# EAGLE design BitRegister (EAGLE 9.2.2)
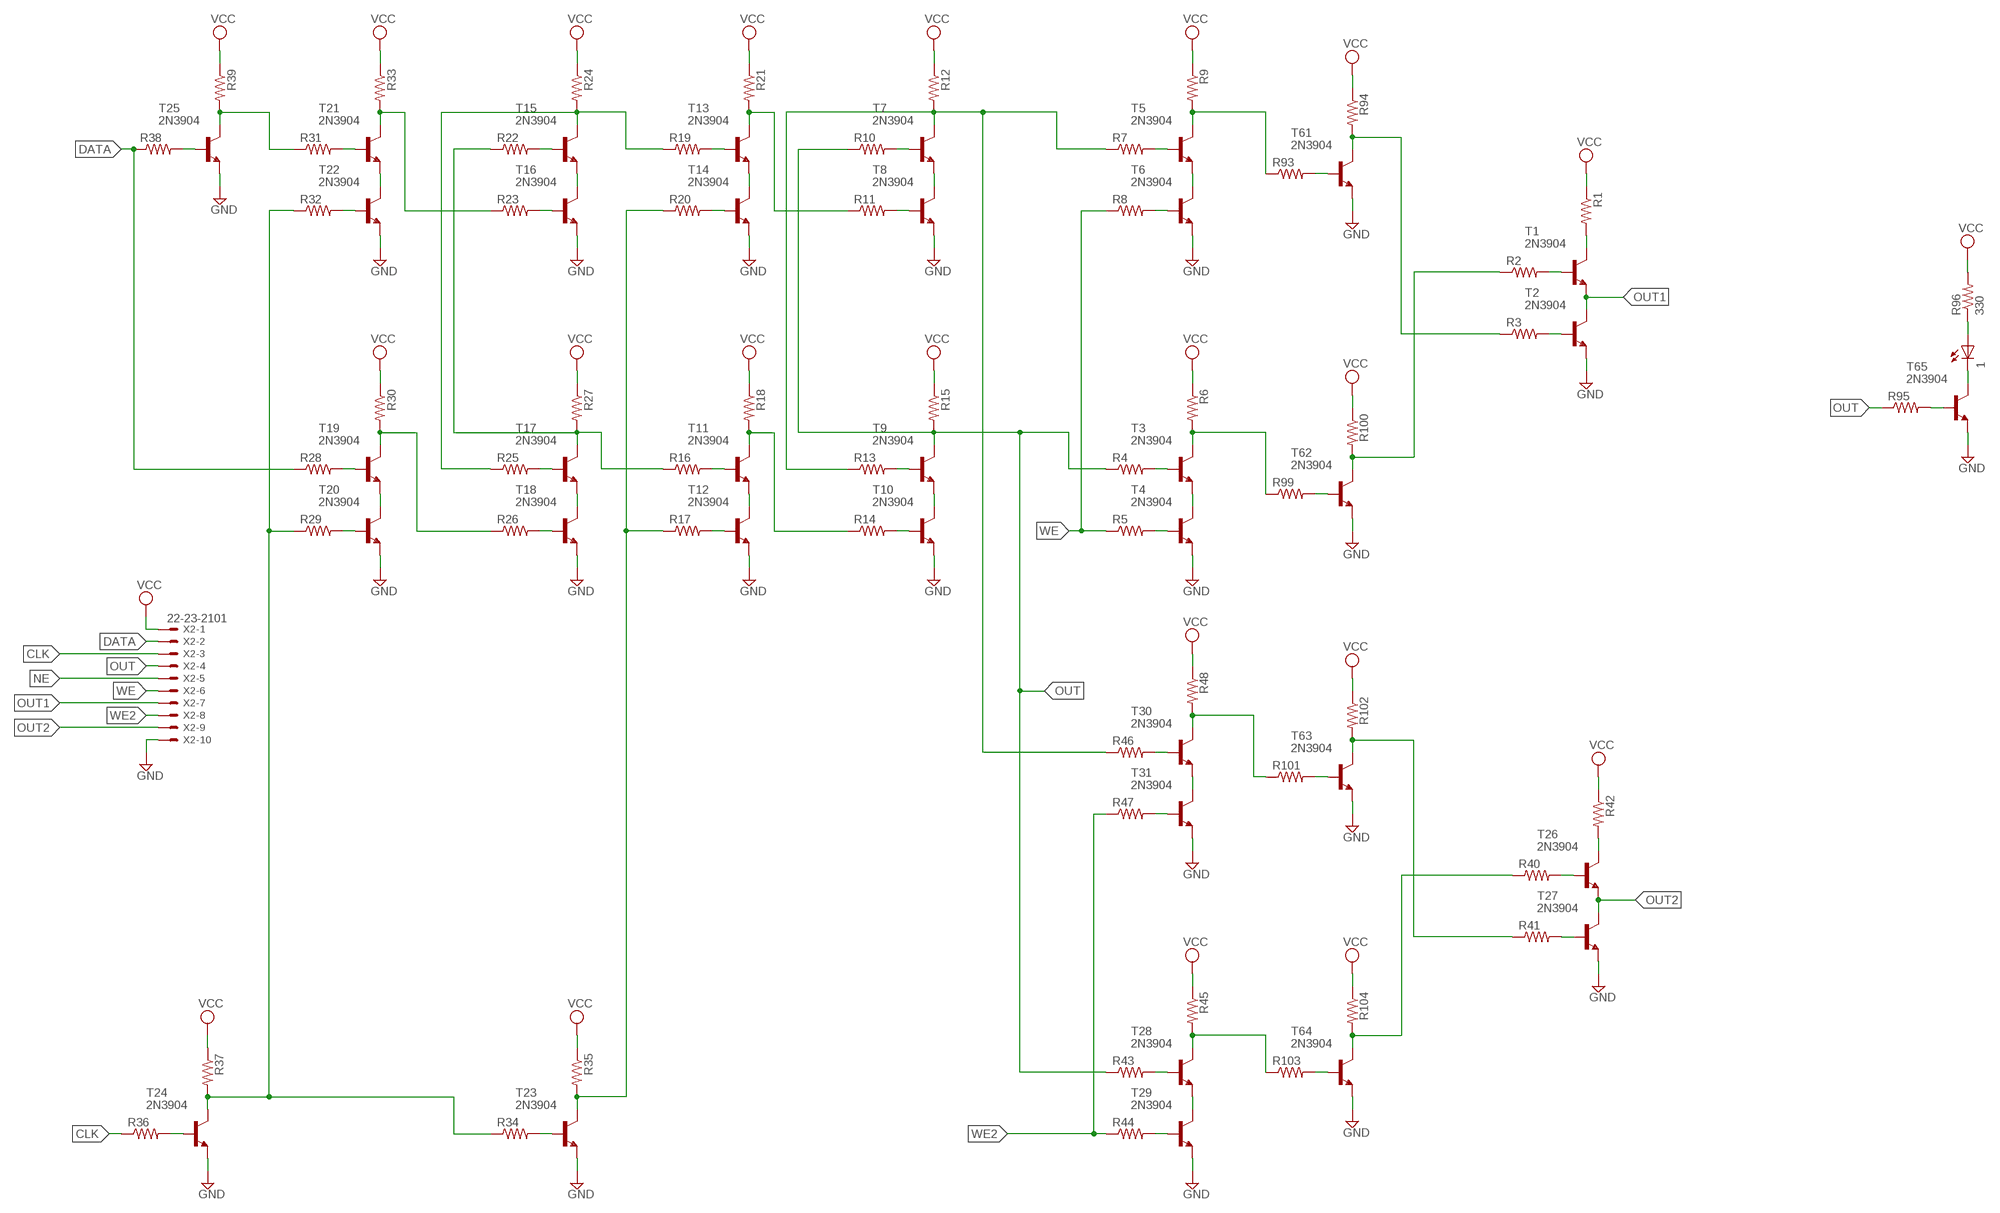
[diagram p0: schematic, sheet 1]

## Parts
1  LED5MM  [LED5MM]
R1  R-US_0309/10  [0309/10]
R2  R-US_0309/10  [0309/10]
R3  R-US_0309/10  [0309/10]
R4  R-US_0309/10  [0309/10]
R5  R-US_0309/10  [0309/10]
R6  R-US_0309/10  [0309/10]
R7  R-US_0309/10  [0309/10]
R8  R-US_0309/10  [0309/10]
R9  R-US_0309/10  [0309/10]
R10  R-US_0309/10  [0309/10]
R11  R-US_0309/10  [0309/10]
R12  R-US_0309/10  [0309/10]
R13  R-US_0309/10  [0309/10]
R14  R-US_0309/10  [0309/10]
R15  R-US_0309/10  [0309/10]
R16  R-US_0309/10  [0309/10]
R17  R-US_0309/10  [0309/10]
R18  R-US_0309/10  [0309/10]
R19  R-US_0309/10  [0309/10]
R20  R-US_0309/10  [0309/10]
R21  R-US_0309/10  [0309/10]
R22  R-US_0309/10  [0309/10]
R23  R-US_0309/10  [0309/10]
R24  R-US_0309/10  [0309/10]
R25  R-US_0309/10  [0309/10]
R26  R-US_0309/10  [0309/10]
R27  R-US_0309/10  [0309/10]
R28  R-US_0309/10  [0309/10]
R29  R-US_0309/10  [0309/10]
R30  R-US_0309/10  [0309/10]
R31  R-US_0309/10  [0309/10]
R32  R-US_0309/10  [0309/10]
R33  R-US_0309/10  [0309/10]
R34  R-US_0309/10  [0309/10]
R35  R-US_0309/10  [0309/10]
R36  R-US_0309/10  [0309/10]
R37  R-US_0309/10  [0309/10]
R38  R-US_0309/10  [0309/10]
R39  R-US_0309/10  [0309/10]
R40  R-US_0309/10  [0309/10]
R41  R-US_0309/10  [0309/10]
R42  R-US_0309/10  [0309/10]
R43  R-US_0309/10  [0309/10]
R44  R-US_0309/10  [0309/10]
R45  R-US_0309/10  [0309/10]
R46  R-US_0309/10  [0309/10]
R47  R-US_0309/10  [0309/10]
R48  R-US_0309/10  [0309/10]
R93  R-US_0309/10  [0309/10]
R94  R-US_0309/10  [0309/10]
R95  R-US_0309/10  [0309/10]
R96  330  R-US_0309/10  [0309/10]
R99  R-US_0309/10  [0309/10]
R100  R-US_0309/10  [0309/10]
R101  R-US_0309/10  [0309/10]
R102  R-US_0309/10  [0309/10]
R103  R-US_0309/10  [0309/10]
R104  R-US_0309/10  [0309/10]
T1  2N3904  [TO92]
T2  2N3904  [TO92]
T3  2N3904  [TO92]
T4  2N3904  [TO92]
T5  2N3904  [TO92]
T6  2N3904  [TO92]
T7  2N3904  [TO92]
T8  2N3904  [TO92]
T9  2N3904  [TO92]
T10  2N3904  [TO92]
T11  2N3904  [TO92]
T12  2N3904  [TO92]
T13  2N3904  [TO92]
T14  2N3904  [TO92]
T15  2N3904  [TO92]
T16  2N3904  [TO92]
T17  2N3904  [TO92]
T18  2N3904  [TO92]
T19  2N3904  [TO92]
T20  2N3904  [TO92]
T21  2N3904  [TO92]
T22  2N3904  [TO92]
T23  2N3904  [TO92]
T24  2N3904  [TO92]
T25  2N3904  [TO92]
T26  2N3904  [TO92]
T27  2N3904  [TO92]
T28  2N3904  [TO92]
T29  2N3904  [TO92]
T30  2N3904  [TO92]
T31  2N3904  [TO92]
T61  2N3904  [TO92]
T62  2N3904  [TO92]
T63  2N3904  [TO92]
T64  2N3904  [TO92]
T65  2N3904  [TO92]
X2  22-23-2101  [22-23-2101]

## Nets
CLK: R36.1 X2.3
DATA: R28.1 R38.1 X2.2
GND: T2.3(E) T4.3(E) T6.3(E) T8.3(E) T10.3(E) T12.3(E) T14.3(E) T16.3(E) T18.3(E) T20.3(E) T22.3(E) T23.3(E) T24.3(E) T25.3(E) T27.3(E) T29.3(E) T31.3(E) T61.3(E) T62.3(E) T63.3(E) T64.3(E) T65.3(E) X2.10
N$1: R1.2 T1.1(C)
N$2: R48.2 R101.1 T30.1(C)
N$3: R3.2 T2.2(B)
N$4: R2.2 T1.2(B)
N$5: R3.1 R94.2 T61.1(C)
N$6: T3.3(E) T4.1(C)
N$7: R5.2 T4.2(B)
N$8: R4.2 T3.2(B)
N$9: R9.2 R93.1 T5.1(C)
N$10: T5.3(E) T6.1(C)
N$11: R8.2 T6.2(B)
N$12: R7.2 T5.2(B)
N$13: R6.2 R99.1 T3.1(C)
N$14: T7.3(E) T8.1(C)
N$15: R11.2 T8.2(B)
N$16: R10.2 T7.2(B)
N$18: T9.3(E) T10.1(C)
N$19: R14.2 T10.2(B)
N$20: R13.2 T9.2(B)
N$21: R14.1 R18.2 T11.1(C)
N$22: T11.3(E) T12.1(C)
N$23: R17.2 T12.2(B)
N$24: R16.2 T11.2(B)
N$25: R11.1 R21.2 T13.1(C)
N$26: T13.3(E) T14.1(C)
N$27: R20.2 T14.2(B)
N$28: R19.2 T13.2(B)
N$29: R19.1 R24.2 R25.1 T15.1(C)
N$30: T15.3(E) T16.1(C)
N$31: R23.2 T16.2(B)
N$32: R22.2 T15.2(B)
N$33: R16.1 R22.1 R27.2 T17.1(C)
N$34: T17.3(E) T18.1(C)
N$35: R26.2 T18.2(B)
N$36: R25.2 T17.2(B)
N$37: R26.1 R30.2 T19.1(C)
N$38: T19.3(E) T20.1(C)
N$39: R29.2 T20.2(B)
N$40: R28.2 T19.2(B)
N$41: R23.1 R33.2 T21.1(C)
N$42: T21.3(E) T22.1(C)
N$43: R32.2 T22.2(B)
N$44: R31.2 T21.2(B)
N$45: R93.2 T61.2(B)
N$46: R34.2 T23.2(B)
N$47: R36.2 T24.2(B)
N$48: R2.1 R100.2 T62.1(C)
N$49: R31.1 R39.2 T25.1(C)
N$50: R38.2 T25.2(B)
N$51: T30.3(E) T31.1(C)
N$52: R47.2 T31.2(B)
N$53: R46.2 T30.2(B)
N$54: R42.2 T26.1(C)
N$55: R40.2 T26.2(B)
N$56: R41.2 T27.2(B)
N$58: R45.2 R103.1 T28.1(C)
N$59: T28.3(E) T29.1(C)
N$60: R44.2 T29.2(B)
N$61: R43.2 T28.2(B)
N$72: R99.2 T62.2(B)
N$104: R17.1 R20.1 R35.2 T23.1(C)
N$105: R29.1 R32.1 R34.1 R37.2 T24.1(C)
N$119: R41.1 R102.2 T63.1(C)
N$120: R101.2 T63.2(B)
N$121: 1.A R96.1
N$122: R95.2 T65.2(B)
N$124: 1.K(C) T65.1(C)
N$127: R40.1 R104.2 T64.1(C)
N$128: R103.2 T64.2(B)
NE: X2.5
NO1: R7.1 R12.2 R13.1 R46.1 T7.1(C)
OUT: R4.1 R10.1 R15.2 R43.1 R95.1 T9.1(C) X2.4
OUT1: T1.3(E) T2.1(C) X2.7
OUT2: T26.3(E) T27.1(C) X2.9
VCC: R1.1 R6.1 R9.1 R12.1 R15.1 R18.1 R21.1 R24.1 R27.1 R30.1 R33.1 R35.1 R37.1 R39.1 R42.1 R45.1 R48.1 R94.1 R96.2 R100.1 R102.1 R104.1 X2.1
WE: R5.1 R8.1 X2.6
WE2: R44.1 R47.1 X2.8

## Library data of the parts
1 = led:LED: LED OSRAM: - CHIPLED LG R971, LG N971, LY N971, LG Q971, LY Q971, LO R971, LY R971 LH N974, LH R974 LS Q976, LO Q976, LY Q976 LO Q996 - Hyper CHIPLED LW Q18S LB Q993, LB Q99A, LB R99A - SideLED LS A670, LO A670, LY A670, LG A670, LP A670 LB A673, LV A673, LT A673, LW A673 LH A674 LY A675 LS A676, LA A676, LO A676, LY A676, LW A676 LS A679, LY A679, LG A679 - Hyper Micro SIDELED® LS Y876, LA Y876, LO Y876, LY Y876 LT Y87S - SmartLED LW L88C, LW L88S LB L89C, LB L89S, LG L890 LS L89K, LO L89K, LY L89K LS L896, LA L896, LO L896, LY L896 - TOPLED LS T670, LO T670, LY T670, LG T670, LP T670 LSG T670, LSP T670, LSY T670, LOP T670, LYG T670 LG T671, LOG T671, LSG T671 LB T673, LV T673, LT T673, LW T673 LH T674 LS T676, LA T676, LO T676, LY T676, LB T676, LH T676, LSB T676, LW T676 LB T67C, LV T67C, LT T67C, LS T67K, LO T67K, LY T67K, LW E67C LS E67B, LA E67B, LO E67B, LY E67B, LB E67C, LV E67C, LT E67C LW T67C LS T679, LY T679, LG T679 LS T770, LO T770, LY T770, LG T770, LP T770 LB T773, LV T773, LT T773, LW T773 LH T774 LS E675, LA E675, LY E675, LS T675 LS T776, LA T776, LO T776, LY T776, LB T776 LHGB T686 LT T68C, LB T68C - Hyper Mini TOPLED® LB M676 - Mini TOPLED Santana® LG M470 LS M47K, LO M47K, LY M47K Source: http://www.osram.convergy.de LUXEON: - LUMILED® LXK2-PW12-R00, LXK2-PW12-S00, LXK2-PW14-U00, LXK2-PW14-V00 LXK2-PM12-R00, LXK2-PM12-S00, LXK2-PM14-U00 LXK2-PE12-Q00, LXK2-PE12-R00, LXK2-PE12-S00, LXK2-PE14-T00, LXK2-PE14-U00 LXK2-PB12-K00, LXK2-PB12-L00, LXK2-PB12-M00, LXK2-PB14-N00, LXK2-PB14-P00, LXK2-PB14-Q00 LXK2-PR12-L00, LXK2-PR12-M00, LXK2-PR14-Q00, LXK2-PR14-R00 LXK2-PD12-Q00, LXK2-PD12-R00, LXK2-PD12-S00 LXK2-PH12-R00, LXK2-PH12-S00 LXK2-PL12-P00, LXK2-PL12-Q00, LXK2-PL12-R00 Source: www.luxeon.com KINGBRIGHT: KA-3528ASYC Source: www.kingbright.com
R1-R48 R93-R96 R99-R104 = resistor:R-US_: RESISTOR, American symbol
T1-T31 T61-T65 = transistor:2N3904: NPN TRANSISTOR
X2 = con-molex:22-23-2101: .100" (2.54mm) Center Header - 10 Pin; MF: MOLEX; MPN: 22-23-2101; OC_FARNELL: 1756828; OC_NEWARK: 94C0765

## Board
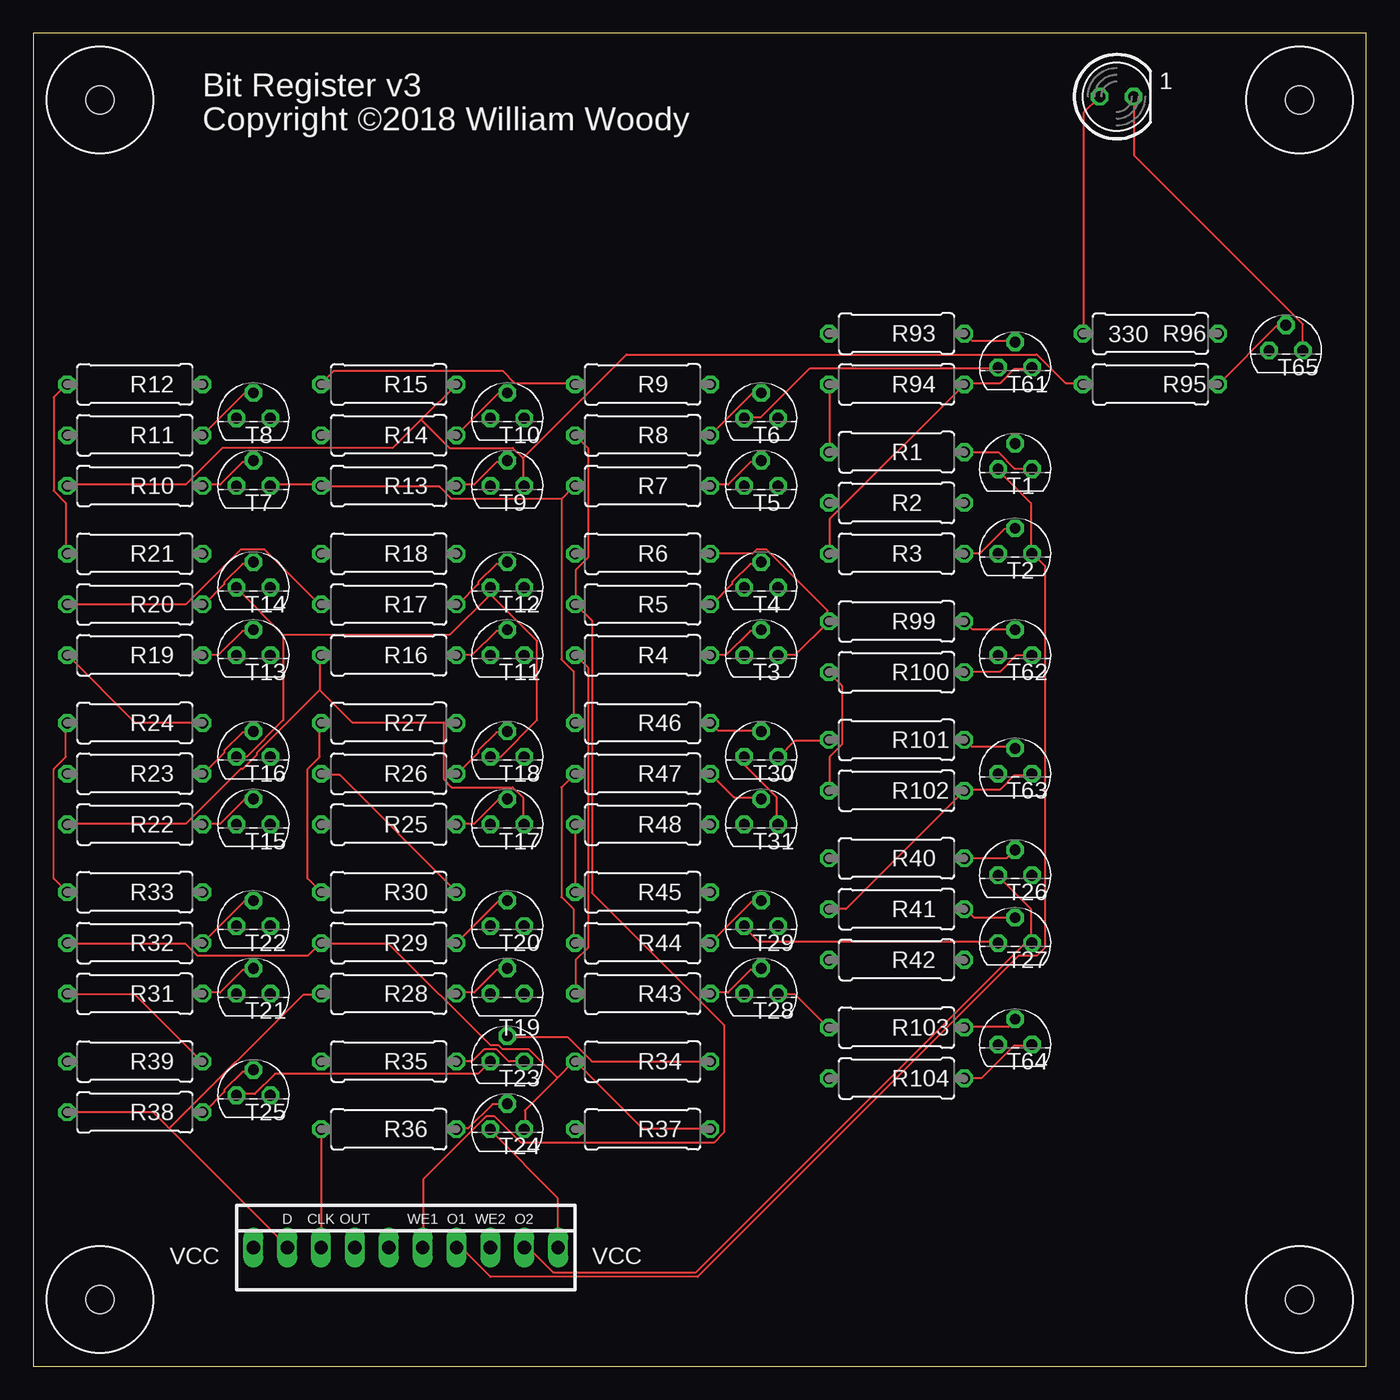
[diagram p1: board, top side]
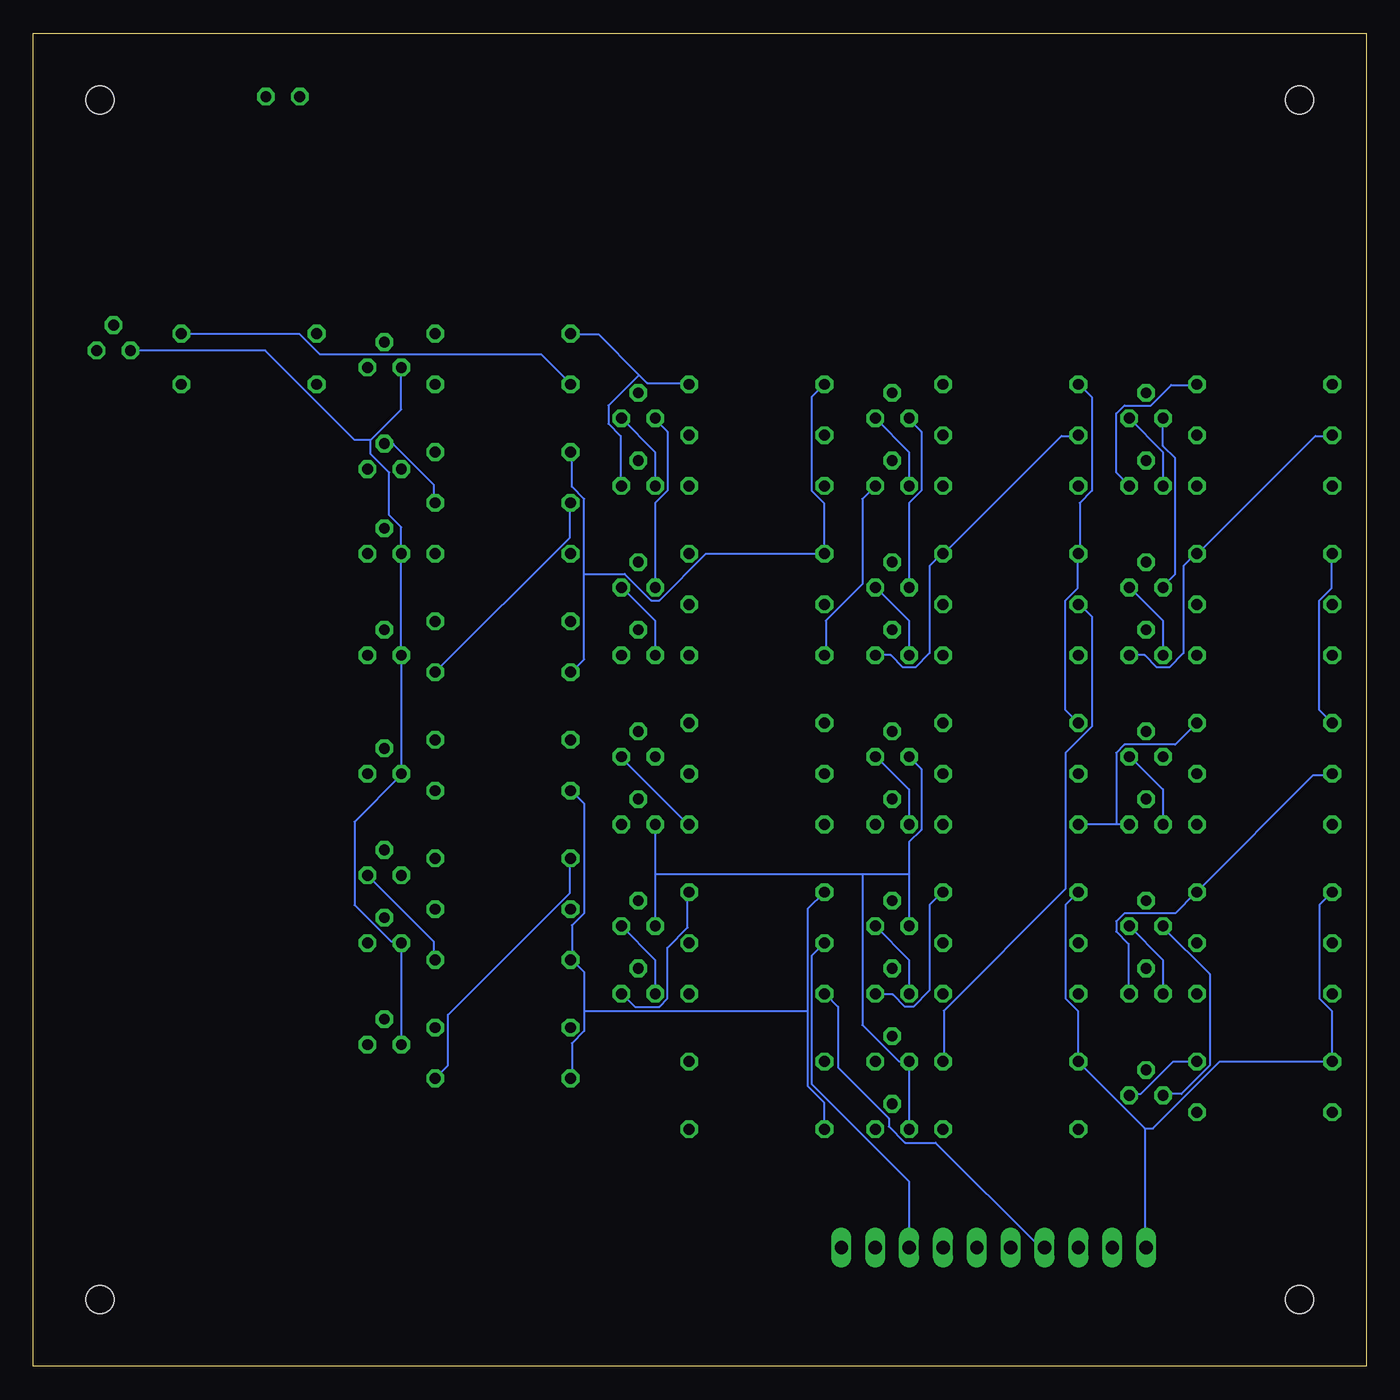
[diagram p2: board, bottom side, seen from below]

Size 100 x 100 mm. Coordinates in mm from the lower left corner, seen from the top.
Outline: 0,0 100,0 100,100 0,100 0,0
Copper layers (1*16): Top 0.035mm / dielectric 1.5mm / Bottom 0.035mm
Design rules "default": minimum track width 6mil, minimum drill 0.35mm, track to track 6mil, track to pad 6mil, pad to pad 6mil, via to via 6mil, smd to smd 6mil, copper to edge 40mil, drill to drill 6mil, minimum pad ring 10mil, minimum via ring 8mil, stop-mask expansion 4mil, vias tented up to drill 0mil, thermal gap 10mil
Holes 2.1 mm at 5,95 95,95 95,5 5,5

### Footprints (pad centres in the part's own frame; a part is rotated, then mirrored left to right if it is on the bottom)
LED5MM = drill 0.813 octagon: A -1.27,0; K 1.27,0
0309/10 = drill 0.813 octagon: 1 -5.08,0; 2 5.08,0
TO92 = drill 0.813 octagon: 1 1.27,0; 2 0,1.905; 3 -1.27,0
22-23-2101 = drill 1 long: 1 -11.43,0; 2 -8.89,0; 3 -6.35,0; 4 -3.81,0; 5 -1.27,0; 6 1.27,0; 7 3.81,0; 8 6.35,0; 9 8.89,0; 10 11.43,0

### Placement (x,y rotation side)
1  81.28,95.25 0 top
R1  64.77,68.58 0 top
R2  64.77,64.77 0 top
R3  64.77,60.96 0 top
R4  45.72,53.34 0 top
R5  45.72,57.15 0 top
R6  45.72,60.96 0 top
R7  45.72,66.04 0 top
R8  45.72,69.85 0 top
R9  45.72,73.66 0 top
R10  7.62,66.04 0 top
R11  7.62,69.85 0 top
R12  7.62,73.66 0 top
R13  26.67,66.04 0 top
R14  26.67,69.85 0 top
R15  26.67,73.66 0 top
R16  26.67,53.34 0 top
R17  26.67,57.15 0 top
R18  26.67,60.96 0 top
R19  7.62,53.34 0 top
R20  7.62,57.15 0 top
R21  7.62,60.96 0 top
R22  7.62,40.64 0 top
R23  7.62,44.45 0 top
R24  7.62,48.26 0 top
R25  26.67,40.64 0 top
R26  26.67,44.45 0 top
R27  26.67,48.26 0 top
R28  26.67,27.94 0 top
R29  26.67,31.75 0 top
R30  26.67,35.56 0 top
R31  7.62,27.94 0 top
R32  7.62,31.75 0 top
R33  7.62,35.56 0 top
R34  45.72,22.86 0 top
R35  26.67,22.86 0 top
R36  26.67,17.78 0 top
R37  45.72,17.78 0 top
R38  7.62,19.05 0 top
R39  7.62,22.86 0 top
R40  64.77,38.1 0 top
R41  64.77,34.29 0 top
R42  64.77,30.48 0 top
R43  45.72,27.94 0 top
R44  45.72,31.75 0 top
R45  45.72,35.56 0 top
R46  45.72,48.26 0 top
R47  45.72,44.45 0 top
R48  45.72,40.64 0 top
R93  64.77,77.47 0 top
R94  64.77,73.66 0 top
R95  83.82,73.66 0 top
R96  83.82,77.47 0 top
R99  64.77,55.88 0 top
R100  64.77,52.07 0 top
R101  64.77,46.99 0 top
R102  64.77,43.18 0 top
R103  64.77,25.4 0 top
R104  64.77,21.59 0 top
T1  73.66,67.31 0 top
T2  73.66,60.96 0 top
T3  54.61,53.34 0 top
T4  54.61,58.42 0 top
T5  54.61,66.04 0 top
T6  54.61,71.12 0 top
T7  16.51,66.04 0 top
T8  16.51,71.12 0 top
T9  35.56,66.04 0 top
T10  35.56,71.12 0 top
T11  35.56,53.34 0 top
T12  35.56,58.42 0 top
T13  16.51,53.34 0 top
T14  16.51,58.42 0 top
T15  16.51,40.64 0 top
T16  16.51,45.72 0 top
T17  35.56,40.64 0 top
T18  35.56,45.72 0 top
T19  35.56,27.94 0 top
T20  35.56,33.02 0 top
T21  16.51,27.94 0 top
T22  16.51,33.02 0 top
T23  35.56,22.86 0 top
T24  35.56,17.78 0 top
T25  16.51,20.32 0 top
T26  73.66,36.83 0 top
T27  73.66,31.75 0 top
T28  54.61,27.94 0 top
T29  54.61,33.02 0 top
T30  54.61,45.72 0 top
T31  54.61,40.64 0 top
T61  73.66,74.93 0 top
T62  73.66,53.34 0 top
T63  73.66,44.45 0 top
T64  73.66,24.13 0 top
T65  93.98,76.2 0 top
X2  27.94,8.89 0 top

### Tracks (layer width: path | path; a pad name or v marks a point on that pad's centre or on a via)
CLK
  Top 0.152: R36.1 21.64,17.68 21.64,8.99 X2.3
DATA
  Top 0.152: R38.1 8.99,19.05 10.21,17.83 | 10.21,17.83 19.05,8.99 X2.2 | 10.21,17.83 20.27,27.89 21.49,27.89 R28.1
GND
  Top 0.152: T6.3 53.34,71.17 54.56,71.17 58.22,74.83 72.39,74.83 T61.3 | X2.10 39.32,8.99 39.32,12.65 34.29,17.68 T24.3 | T23.3 33.38,21.95 18.14,21.95 16.61,20.42 15.24,20.42 T25.3 | T16.3 16,45.72 18.75,48.46 18.75,54.86 | 18.75,54.86 15.24,58.37 T14.3 | 34.29,57.91 T12.3 34.29,58.37 | 34.29,57.91 37.8,54.41 37.8,48.46 35.05,45.72 T18.3 | 18.75,54.86 31.24,54.86 34.29,57.91 | T27.3 72.39,31.85 54.41,31.85 53.34,32.92 T29.3
  Bottom 0.152: T4.3 53.34,64.77 52.43,65.68 52.43,70.1 53.34,71.02 T6.3 | T64.3 T27.3 72.39,31.85 73.15,31.85 75.89,34.59 75.89,40.84 72.39,44.35 T63.3 T62.3 T2.3 72.39,62.94 73.3,63.86 73.3,67.06 74.68,68.43 74.68,69.49 | T61.3 72.39,71.78 74.68,69.49 | T65.3 82.6,76.2 75.89,69.49 74.68,69.49 | T25.3 15.24,20.42 13.87,20.42 11.73,22.55 11.73,29.41 15.24,32.92 T22.3 | T24.3 T23.3 35.05,22.86 37.8,25.6 37.8,36.88 | T8.3 15.24,69.04 14.33,68.12 14.33,59.44 15.24,58.52 T14.3 | T12.3 34.29,64.77 33.38,65.68 33.38,70.1 34.29,71.02 T10.3 | T31.3 53.34,36.88 | 53.34,36.88 T29.3 | 34.29,36.88 34.29,39.32 33.38,40.23 33.38,44.81 T18.3 | 34.29,36.88 T20.3 | 34.29,36.88 37.8,36.88 | 37.8,36.88 53.34,36.88
N$1
  Top 0.152: R1.2 72.39,68.58 73.61,67.36 74.83,67.36 T1.1
N$2
  Top 0.152: R101.1 59.59,46.94 57.15,46.94 55.93,45.72 T30.1
  Bottom 0.152: R48.2 50.9,40.69 55.93,45.72 T30.1
N$3
  Top 0.152: R3.2 71.02,60.96 72.85,62.79 73.61,62.79 T2.2
N$4
  Bottom 0.152: R2.2 69.95,64.77 69.95,66.14 73,69.19 73.61,69.19 T1.2
N$5
  Top 0.152: R3.1 59.74,60.96 59.74,63.55 R94.2 69.95,73.76 72.54,73.76 73.61,74.83 74.83,74.83 T61.1
N$6
  Bottom 0.152: T3.3 53.34,55.93 55.78,58.37 T4.1
N$7
  Top 0.152: R5.2 50.9,57.15 52.43,58.67 52.43,58.83 53.8,60.2 54.56,60.2 T4.2
N$8
  Top 0.152: R4.2 51.97,53.34 53.8,55.17 54.56,55.17 T3.2
N$9
  Bottom 0.152: 54.56,74.37 57.61,77.42 59.59,77.42 R93.1 | 54.56,74.37 53.95,73.76 50.9,73.76 R9.2 | 54.56,74.37 56.84,72.08 56.84,70.71 55.93,69.8 55.93,66.14 T5.1
N$10
  Bottom 0.152: T5.3 53.34,68.58 T6.1
N$11
  Top 0.152: R8.2 53.95,73 54.56,73 T6.2
N$12
  Top 0.152: R7.2 50.9,66.14 52.12,66.14 53.8,67.82 54.56,67.82 T5.2
N$13
  Top 0.152: R6.2 53.95,60.96 54.25,61.27 55.02,61.27 59.59,56.69 59.59,55.93 R99.1 57.15,53.34 T3.1
N$14
  Bottom 0.152: T7.3 15.24,68.58 T8.1
N$15
  Top 0.152: R11.2 15.85,73 16.46,73 T8.2
N$16
  Top 0.152: R10.2 12.8,66.14 14.02,66.14 15.7,67.82 16.46,67.82 T7.2
N$18
  Bottom 0.152: T9.3 34.29,68.58 T10.1
N$19
  Top 0.152: R14.2 34.9,73 35.51,73 T10.2
N$20
  Top 0.152: R13.2 31.85,66.14 33.07,66.14 34.75,67.82 35.51,67.82 T9.2
N$21
  Bottom 0.152: T11.1 35.66,53.34 34.75,52.43 33.83,52.43 32.77,53.49 32.77,60.05 31.85,60.96 R18.2 31.7,60.96 22.86,69.8 21.64,69.8 R14.1
N$22
  Bottom 0.152: T11.3 34.29,55.93 36.73,58.37 T12.1
N$23
  Top 0.152: R17.2 31.85,57.15 33.38,58.67 33.38,58.83 34.75,60.2 35.51,60.2 T12.2
N$24
  Top 0.152: R16.2 32.92,53.34 34.75,55.17 35.51,55.17 T11.2
N$25
  Bottom 0.152: T13.1 16.61,53.34 15.7,52.43 14.78,52.43 13.72,53.49 13.72,60.05 12.8,60.96 R21.2 12.65,60.96 3.81,69.8 2.59,69.8 R11.1
N$26
  Bottom 0.152: T13.3 15.24,55.93 17.68,58.37 T14.1
N$27
  Top 0.152: R20.2 12.8,57.15 14.33,58.67 14.33,58.83 15.7,60.2 16.46,60.2 T14.2
N$28
  Top 0.152: R19.2 13.87,53.34 15.7,55.17 16.46,55.17 T13.2
N$29
  Top 0.152: R24.2 12.65,48.31 7.62,48.31 2.59,53.34 R19.1
  Bottom 0.152: 18.75,40.69 21.49,40.69 R25.1 | 18.75,40.69 17.83,40.69 T15.1 | 18.75,40.69 18.75,46.02 18.14,46.63 14.33,46.63 R24.2
N$30
  Bottom 0.152: T15.3 15.24,43.28 17.68,45.72 T16.1
N$31
  Top 0.152: R23.2 12.8,44.5 14.33,46.02 14.33,46.18 15.7,47.55 16.46,47.55 T16.2
N$32
  Top 0.152: R22.2 12.8,40.69 14.02,40.69 15.85,42.52 16.46,42.52 T15.2
N$33
  Top 0.152: 21.49,50.75 16.76,46.02 16.76,45.87 15.7,44.81 15.54,44.81 11.43,40.69 2.59,40.69 R22.1 | 21.49,50.75 21.49,53.34 R16.1 | 30.79,48.31 23.93,48.31 21.49,50.75 | 30.79,48.31 31.7,48.31 R27.2 | 30.79,48.31 30.79,44.04 31.39,43.43 35.97,43.43 36.73,42.67 36.73,40.69 T17.1
N$34
  Bottom 0.152: T17.3 34.29,43.28 36.73,45.72 T18.1
N$35
  Top 0.152: R26.2 31.85,44.5 33.38,46.02 33.38,46.18 34.75,47.55 35.51,47.55 T18.2
N$36
  Top 0.152: R25.2 31.85,40.69 33.07,40.69 34.9,42.52 35.51,42.52 T17.2
N$37
  Top 0.152: R26.1 21.64,44.35 23.01,44.35 31.7,35.66 R30.2
  Bottom 0.152: T19.1 36.73,27.89 35.51,27.89 34.59,26.98 33.98,26.98 32.77,28.19 32.77,34.59 31.85,35.51 R30.2
N$38
  Bottom 0.152: T19.3 34.29,30.48 T20.1
N$39
  Top 0.152: R29.2 34.9,34.9 35.51,34.9 T20.2
N$40
  Top 0.152: R28.2 31.85,28.04 33.07,28.04 34.75,29.72 35.51,29.72 T19.2
N$41
  Bottom 0.152: T21.1 17.83,28.04 17.83,31.7 18.75,32.61 18.75,33.38 18.14,33.98 14.33,33.98 12.8,35.51 R33.2 12.65,35.66 3.96,44.35 2.59,44.35 R23.1
N$42
  Bottom 0.152: T21.3 15.24,30.48 T22.1
N$43
  Top 0.152: R32.2 15.85,34.9 16.46,34.9 T22.2
N$44
  Top 0.152: R31.2 12.8,28.04 14.02,28.04 15.7,29.72 16.46,29.72 T21.2
N$45
  Top 0.152: T61.2 73.61,76.96 70.41,76.96 69.95,77.42 R93.2
N$46
  Top 0.152: R34.2 41.91,22.86 40.08,24.69 35.66,24.69 T23.2
N$47
  Top 0.152: R36.2 31.85,17.83 32.61,17.83 34.44,19.66 35.51,19.66 T24.2
N$48
  Top 0.152: T62.1 73.76,53.34 72.54,52.12 69.95,52.12 R100.2
  Bottom 0.152: R100.2 59.74,62.18 59.74,64.77 R2.1
N$49
  Top 0.152: R31.1 2.59,27.89 7.62,27.89 12.65,22.86 R39.2
  Bottom 0.152: R39.2 14.48,22.86 16.92,20.42 17.68,20.42 T25.1
N$50
  Top 0.152: R38.2 12.8,19.05 14.33,20.57 14.33,20.73 15.7,22.1 16.46,22.1 T25.2
N$51
  Top 0.152: T30.3 53.34,45.11 55.78,42.67 55.78,40.69 T31.1
N$52
  Top 0.152: R47.2 52.58,42.67 54.56,42.67 T31.2
N$53
  Top 0.152: R46.2 51.36,47.7 54.56,47.7 T30.2
N$54
  Bottom 0.152: T26.1 69.95,31.85 69.95,30.48 R42.2
N$55
  Top 0.152: R40.2 73,38.1 73.61,38.71 T26.2
N$56
  Top 0.152: T27.2 73.61,33.68 70.56,33.68 69.95,34.29 R41.2
N$58
  Top 0.152: T28.1 55.93,27.89 57.15,27.89 59.59,25.45 R103.1
  Bottom 0.152: R45.2 50.9,35.51 50.9,32.92 52.43,31.39 52.43,27.58 53.03,26.98 54.86,26.98 55.78,27.89 T28.1
N$59
  Bottom 0.152: T28.3 53.34,30.48 T29.1
N$60
  Top 0.152: R44.2 53.95,34.9 54.56,34.9 T29.2
N$61
  Top 0.152: R43.2 50.9,28.04 52.12,28.04 53.8,29.72 54.56,29.72 T28.2
N$72
  Top 0.152: R99.2 70.41,55.32 73.61,55.32 T62.2
N$104
  Top 0.152: R35.2 32.92,22.86 33.83,23.77 34.75,23.77 35.66,22.86 T23.1 | R20.1 11.43,57.15 15.54,61.27 17.37,61.27 21.49,57.15 R17.1
  Bottom 0.152: R35.2 31.7,22.86 31.7,26.67 22.55,35.81 22.55,46.02 20.57,48.01 20.57,56.24 21.49,57.15 R17.1
N$105
  Top 0.152: R32.1 2.59,31.7 11.43,31.7 12.34,30.79 20.57,30.79 21.49,31.7 R29.1 21.64,31.7 26.67,31.7 34.29,24.08 34.9,24.08 35.2,23.77 37.19,23.77 39.32,21.64 | 39.32,21.64 40.54,22.86 R34.1 40.69,22.86 45.72,17.83 50.75,17.83 R37.2 | 39.32,21.64 36.88,19.2 36.88,17.83 T24.1
N$119
  Top 0.152: R41.1 60.96,34.29 R102.2 69.95,43.28 72.54,43.28 73.61,44.35 74.83,44.35 T63.1
N$120
  Top 0.152: T63.2 73.61,46.48 70.41,46.48 69.95,46.94 R101.2
N$121
  Top 0.152: 1.A 78.79,94.03 78.79,77.57 R96.1
N$122
  Top 0.152: R95.2 93.27,78.03 93.88,78.03 T65.2
N$124
  Top 0.152: T65.1 95.25,78.18 82.6,90.83 82.6,95.25 1.K
N$127
  Top 0.152: T64.1 74.83,24.08 73.61,24.08 71.17,21.64 69.95,21.64 R104.2
  Bottom 0.152: R104.2 68.89,22.55 68.89,26.36 59.74,35.51 59.74,38.1 R40.1
N$128
  Top 0.152: R103.2 69.95,25.45 73.15,25.45 73.61,25.91 T64.2
NO1
  Top 0.152: T7.1 17.83,66.14 21.49,66.14 R13.1 21.64,65.99 30.48,65.99 31.39,65.08 39.62,65.08 | 39.62,65.08 39.62,53.03 40.54,52.12 40.54,48.31 R46.1 | 39.62,65.08 40.54,65.99 R7.1
  Bottom 0.152: R12.2 12.8,73.61 14.63,73.61 16.15,72.08 18.14,72.08 18.75,71.48 18.75,67.06 17.83,66.14 T7.1
OUT
  Top 0.152: R43.1 40.69,28.04 40.69,30.48 41.6,31.39 41.6,52.43 40.69,53.34 R4.1 | R15.2 29.11,71.02 | 29.11,71.02 26.98,68.89 14.17,68.89 11.43,66.14 2.59,66.14 R10.1 | 36.73,68.12 36.73,66.14 T9.1 | 36.73,68.12 35.97,68.89 31.24,68.89 29.11,71.02 | 36.73,68.12 44.5,75.89 75.29,75.89 77.42,73.76 78.64,73.76 R95.1
  Bottom 0.152: X2.4 24.23,8.99 24.54,8.99 32.31,16.76 34.59,16.76 35.81,17.98 35.81,18.59 39.62,22.4 39.62,26.98 40.54,27.89 R43.1 | T9.1 37.8,65.08 37.8,58.67 40.54,55.93 40.54,53.34 R4.1
OUT1
  Top 0.152: T1.3 72.39,67.21 74.83,64.77 74.83,60.96 T2.1 74.98,60.96 75.89,60.05 75.89,31.39 75.29,30.79 73.91,30.79 49.84,6.71 34.29,6.71 32.16,8.84 31.85,8.84 X2.7
OUT2
  Top 0.152: T26.3 72.39,36.73 74.83,34.29 74.83,31.85 T27.1 74.83,31.7 74.37,31.7 49.68,7.01 39.01,7.01 37.19,8.84 36.88,8.84 X2.9
VCC
  Top 0.152: R21.1 2.44,60.96 2.44,64.77 1.52,65.68 1.52,72.69 2.44,73.61 R12.1 | R33.1 1.52,36.58 1.52,44.81 2.44,45.72 2.44,48.16 R24.1 | R30.1 20.57,36.58 20.57,44.81 21.49,45.72 21.49,48.16 R27.1 | R9.1 40.54,73.76 36.12,73.76 35.2,74.68 22.55,74.68 21.64,73.76 R15.1 | R1.1 59.74,68.58 59.74,73.61 R94.1 | R48.1 40.69,40.54 40.69,35.66 R45.1 | R102.1 59.74,43.28 59.74,45.72 60.66,46.63 60.66,51.05 59.74,51.97 R100.1
  Bottom 0.152: 2.59,22.86 2.59,26.67 3.5,27.58 3.5,34.59 R33.1 | R24.1 3.5,49.23 3.5,57.45 2.59,58.37 2.59,60.96 R21.1 | 40.69,60.96 40.69,64.77 41.6,65.68 41.6,72.69 R9.1 | R15.1 21.49,73.61 20.57,72.69 20.57,65.68 21.49,64.77 21.49,60.96 R18.1 21.64,60.96 21.64,58.37 22.55,57.45 22.55,49.23 R27.1 | 21.64,22.86 21.64,26.67 22.55,27.58 22.55,34.59 R30.1 | 16.61,17.83 16.61,8.99 X2.1 | 21.64,22.86 16.61,17.83 | 21.64,22.86 R35.1 | 2.59,22.86 10.97,22.86 16,17.83 16.61,17.83 | 2.59,22.86 R39.1 | R96.2 88.85,77.42 80.01,77.42 78.49,75.89 61.87,75.89 59.74,73.76 R94.1 | 41.91,26.67 41.91,34.29 R45.1 | 41.91,26.67 41.91,21.03 40.69,19.81 40.69,17.83 R37.1 | 58.67,26.67 58.67,29.57 59.59,30.48 | 58.67,26.67 58.67,25.15 59.59,24.23 59.59,21.64 R104.1 | 59.59,30.48 59.59,33.07 58.67,33.98 58.67,42.22 59.59,43.13 R102.1 | 59.59,30.48 R42.1 | 58.67,26.67 41.91,26.67 | 58.67,59.44 58.67,53.03 59.59,52.12 R100.1 | 58.67,59.44 58.67,65.08 59.59,65.99 59.59,68.58 R1.1 | 40.69,60.96 49.53,60.96 53.03,57.45 53.65,57.45 55.63,59.44 58.67,59.44 | 40.69,60.96 R6.1
WE
  Top 0.152: 40.69,57.15 40.69,59.74 41.6,60.66 41.6,68.89 R8.1 | 40.69,57.15 41.91,55.93 41.91,35.51 51.82,25.6 51.82,17.53 51.05,16.76 36.58,16.76 34.59,18.75 33.98,18.75 29.26,14.02 29.26,8.99 X2.6 | 40.69,57.15 R5.1
WE2
  Top 0.152: R47.1 39.62,43.43 39.62,35.2 40.54,34.29 40.54,31.85 R44.1
  Bottom 0.152: X2.8 34.29,13.87 41.6,21.18 41.6,30.79 R44.1

### Text on the board
tPlace: Bit Register v3 | Copyright ©2018 William Woody | D | CLK | OUT | WE1 | O1 | WE2 | O2 | VCC | VCC